# Altium schematic sheet CMPower.SchDoc
size Letter
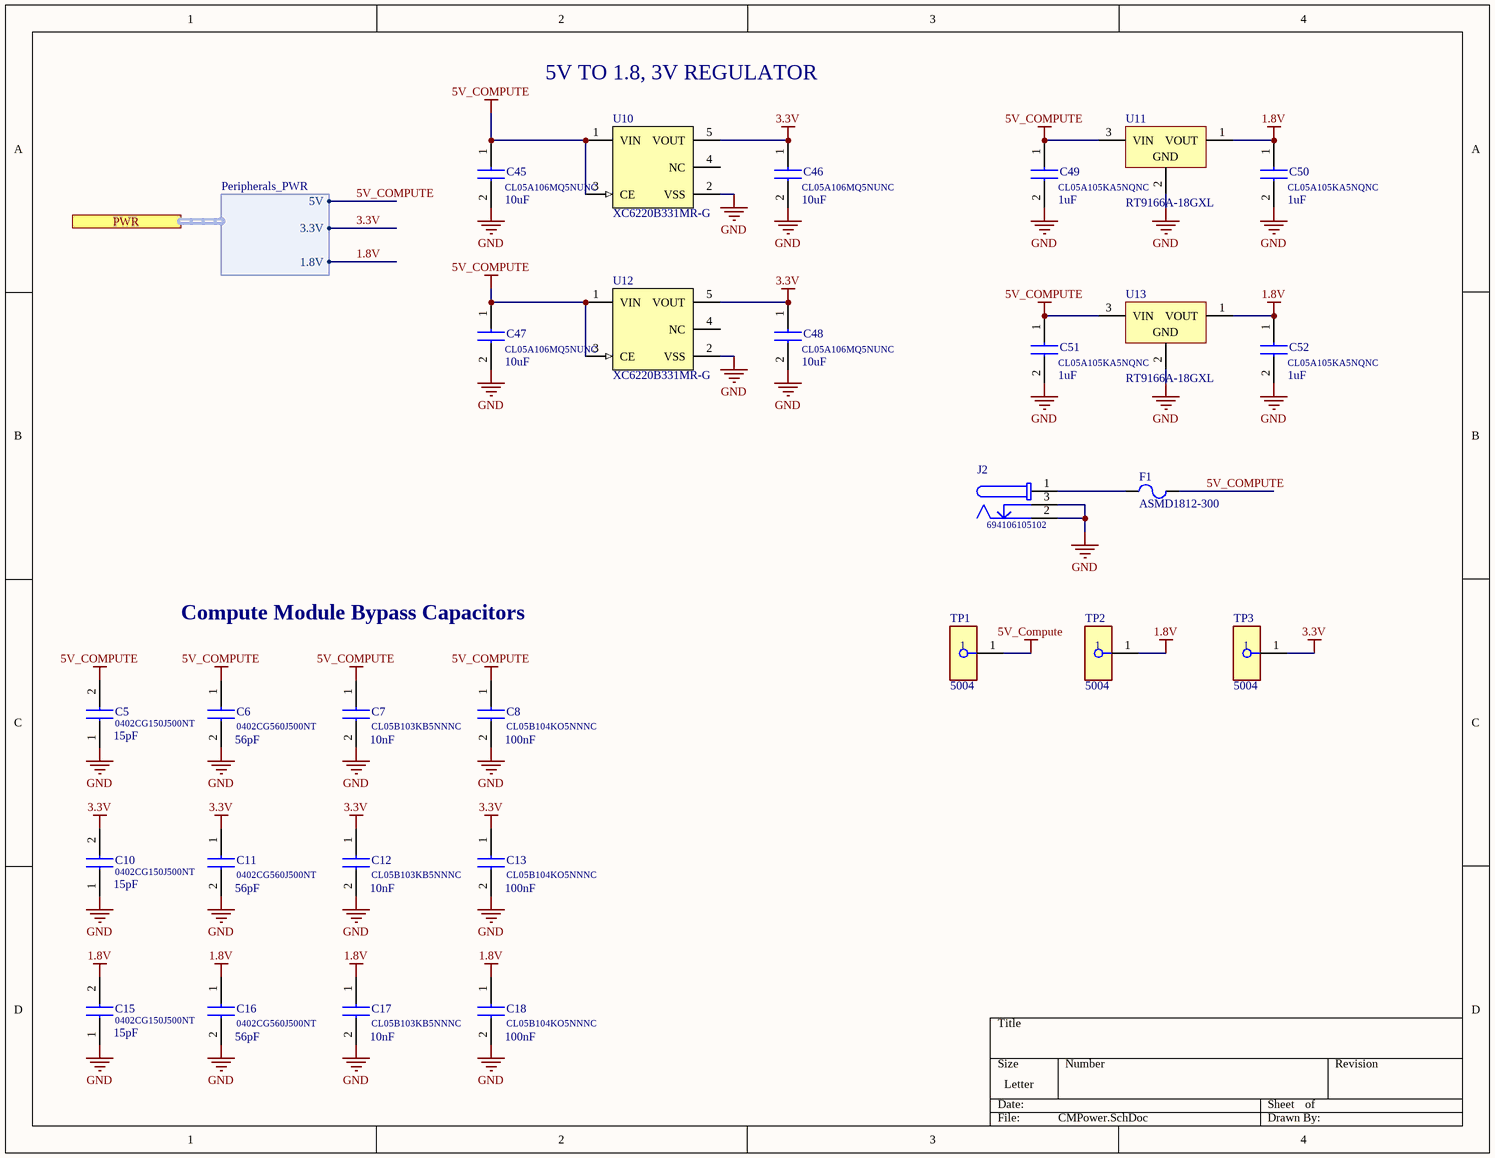
[diagram p0: CMPower.SchDoc]

## Parts
C5  0402CG150J500NT  value 15pF  [CAPC1005X90N]
C6  0402CG560J500NT  value 56pF  [CAPC1005X55N]
C7  CL05B103KB5NNNC  value 10nF  [CAPC1005X55N]
C8  CL05B104KO5NNNC  value 100nF  [CAPC1005X55N]
C10  0402CG150J500NT  value 15pF  [CAPC1005X90N]
C11  0402CG560J500NT  value 56pF  [CAPC1005X55N]
C12  CL05B103KB5NNNC  value 10nF  [CAPC1005X55N]
C13  CL05B104KO5NNNC  value 100nF  [CAPC1005X55N]
C15  0402CG150J500NT  value 15pF  [CAPC1005X90N]
C16  0402CG560J500NT  value 56pF  [CAPC1005X55N]
C17  CL05B103KB5NNNC  value 10nF  [CAPC1005X55N]
C18  CL05B104KO5NNNC  value 100nF  [CAPC1005X55N]
C45  CL05A106MQ5NUNC  value 10uF  [CAPC1005X55N]
C46  CL05A106MQ5NUNC  value 10uF  [CAPC1005X55N]
C47  CL05A106MQ5NUNC  value 10uF  [CAPC1005X55N]
C48  CL05A106MQ5NUNC  value 10uF  [CAPC1005X55N]
C49  CL05A105KA5NQNC  value 1uF  [CAPC1005X55N]
C50  CL05A105KA5NQNC  value 1uF  [CAPC1005X55N]
C51  CL05A105KA5NQNC  value 1uF  [CAPC1005X55N]
C52  CL05A105KA5NQNC  value 1uF  [CAPC1005X55N]
F1  ASMD1812-300  [LFUS-FUSE1812-71_V]
J2  694106105102  [694106105102]
TP1  5004  [FP-5004-MFG]
TP2  5004  [FP-5004-MFG]
TP3  5004  [FP-5004-MFG]
U10  XC6220B331MR-G  [TORX-SOT-25-5_M]
U11  RT9166A-18GXL  [SOT-89_N]
U12  XC6220B331MR-G  [TORX-SOT-25-5_M]
U13  RT9166A-18GXL  [SOT-89_N]

## Ports
PWR (harness Peripherals_PWR)

## Harnesses
Peripherals_PWR: 5V, 3.3V, 1.8V

## Nets
1.8V: C15.2 C16.1 C17.1 C18.1 C50.1 C52.1 TP2.1 U11.1(VOUT) U13.1(VOUT) ; port PWR.1.8V
3.3V: C10.2 C11.1 C12.1 C13.1 C46.1 C48.1 TP3.1 U10.5(VOUT) U12.5(VOUT) ; port PWR.3.3V
5V_COMPUTE: C5.2 C6.1 C7.1 C8.1 C45.1 C47.1 C49.1 C51.1 F1.2 TP1.1 U10.1(VIN) U10.3(CE) U11.3(VIN) U12.1(VIN) U12.3(CE) U13.3(VIN) ; port PWR.5V
GND: C5.1 C6.2 C7.2 C8.2 C10.1 C11.2 C12.2 C13.2 C15.1 C16.2 C17.2 C18.2 C45.2 C46.2 C47.2 C48.2 C49.2 C50.2 C51.2 C52.2 J2.2 J2.3 U10.2(VSS) U11.2(GND) U12.2(VSS) U13.2(GND)
NetF1_1: F1.1 J2.1

Not connected (* = marked no-connect by the designer): U10 4(NC); U12 4(NC)

## Notes on the sheet
- 5V TO 1.8, 3V REGULATOR
- Compute Module Bypass Capacitors

## Library data of the parts
C5 C10 C15 = C0402C150J4GACTU: 15pF 0402; Manufacturer_Name: Kemet; Datasheet Link: https://content.kemet.com/datasheets/KEM_C1002_X7R_SMD.pdf; Height: 0.55mm; Manufacturer_Part_Number: C0402C150J4GACTU; Arrow Part Number: C0402C150J4GACTU; Arrow Price/Stock: https://www.arrow.com/en/products/c0402c150j4gactu/kemet-corporation; Mouser Part Number: 80-C0402C150J4G; Mouser Price/Stock: https://www.mouser.com/Search/Refine.aspx?Keyword=80-C0402C150J4G
C6 C11 C16 = C0402C560K5RACTU: 56pF 0402; Manufacturer_Name: Kemet; Datasheet Link: https://content.kemet.com/datasheets/KEM_C1002_X7R_SMD.pdf; Height: 0.55mm; Manufacturer_Part_Number: C0402C560K5RACTU; Arrow Part Number: C0402C560K5RACTU; Mouser Part Number: 80-C0402C560K5RACTU; Mouser Price/Stock: https://www.mouser.co.uk/ProductDetail/KEMET/C0402C560K5RACTU?qs=gt1LBUVyoHmQZW5v3ySgNQ%3D%3D
C7 C12 C17 = C0402C103K8RACTU: 10nF 0402; Manufacturer_Name: Kemet; Datasheet Link: https://content.kemet.com/datasheets/KEM_C1002_X7R_SMD.pdf; Height: 0.55mm; Manufacturer_Part_Number: C0402C103K8RACTU; Arrow Part Number: C0402C103K8RACTU; Arrow Price/Stock: https://www.arrow.com/en/products/c0402c103k8ractu/kemet-corporation; Mouser Part Number: 80-C0402C103K8R; Mouser Price/Stock: https://www.mouser.co.uk/ProductDetail/KEMET/C0402C103K8RACTU?qs=JAINH4q0Y0HkMNTUebnT7w%3D%3D
C8 C13 C18 = C0402C560K5RACTU: 100nF 0402; Manufacturer_Name: Kemet; Datasheet Link: https://content.kemet.com/datasheets/KEM_C1002_X7R_SMD.pdf; Height: 0.55mm; Manufacturer_Part_Number: C0402C560K5RACTU; Arrow Part Number: C0402C560K5RACTU; Mouser Part Number: 80-C0402C560K5RACTU; Mouser Price/Stock: https://www.mouser.co.uk/ProductDetail/KEMET/C0402C560K5RACTU?qs=gt1LBUVyoHmQZW5v3ySgNQ%3D%3D
C45-C48 = C0402C560K5RACTU: 10uF 0402; Manufacturer_Name: Kemet; Datasheet Link: https://content.kemet.com/datasheets/KEM_C1002_X7R_SMD.pdf; Height: 0.55mm; Manufacturer_Part_Number: C0402C560K5RACTU; Arrow Part Number: C0402C560K5RACTU; Mouser Part Number: 80-C0402C560K5RACTU; Mouser Price/Stock: https://www.mouser.co.uk/ProductDetail/KEMET/C0402C560K5RACTU?qs=gt1LBUVyoHmQZW5v3ySgNQ%3D%3D
C49-C52 = C0402C560K5RACTU: 1uF 0402; Manufacturer_Name: Kemet; Datasheet Link: https://content.kemet.com/datasheets/KEM_C1002_X7R_SMD.pdf; Height: 0.55mm; Manufacturer_Part_Number: C0402C560K5RACTU; Arrow Part Number: C0402C560K5RACTU; Mouser Part Number: 80-C0402C560K5RACTU; Mouser Price/Stock: https://www.mouser.co.uk/ProductDetail/KEMET/C0402C560K5RACTU?qs=gt1LBUVyoHmQZW5v3ySgNQ%3D%3D
F1 = CMP-0257-00001-1: Resettable PTC, 1812, 3 A Ihold, 5 A Itrip, 8V max; PartNumber: 1812L150ZR; Itrip: 3 A; Vmax: 8 Vdc; Ihold: 1.5 A; Imax: 100 A; PackageReference: FUSE1812-71; ComponentLink1Description: Manufacturer URL; DatasheetVersion: 6/2012; ComponentLink2URL: http://www.littelfuse.com/products/resettable-ptcs/surface-mount/1812l/~/media/Electronics_Technical/Datasheets/Resettable_PTCs/Littelfuse_PTC_1812L_Datasheet.pdf; PackageVersion: 6/2012; PackageDescription: 2-Pin SMT Fuse, 4.55 x 3.24 mm Body; ComponentLink1URL: http://www.littelfuse.com/; ComponentLink2Description: Datasheet
J2 = CMP-1502-00176-1: DC Power Jack Connector with Pegs WR-DC, Male, Right Angled, SMT, 5 A, 24 V; Manufacturer: Wurth Elektronik; Plug Outer Diameter: 5.5mm; Opening Diameter: 6.4mm; Plug Inner Diameter: 2.05mm; Rated Current: 5A; Working Voltage: 24V; Publisher: WurthElektronik; Operating Temperature: -40to85degC; Packaging: TapeandReel; Part Number: 694106105102; Manufacturer URL: http://www.we-online.de; Mounting Technology: SMT; Gender: Male; Package Reference: 694106105102; Datasheet URL: http://katalog.we-online.de/em/datasheet/6941xx105102.pdf; Orientation: RightAngled
TP1-TP3 = CMP-2000-05575-2: PC TEST POINT MINIATURE YELLOW; Manufacturer: Keystone; Number Of Contacts: 1; Is Female: yes; Device Class L1: Connectors; Manufacturer Part Number: 5004; Digikey Description: PC TEST POINT MINIATURE YELLOW; ComponentLink2URL: https://www.keyelco.com/product-pdf.cfm?p=1313; Lead Free: Yes; ComponentLink2Description: Datasheet; Category: Conn; Height: 4.72mm; Octopart: https://octopart.com/5004-keystone-28591; Mouser Description: TEST POINT PC MINI .040"D YELLOW; Device Class L3: unset; Contact Material: Silver; Package: 5004; Automotive: No; Device Class L2: unset; RoHS: TRUE
U10 U12 = CMP-0599-00001-2: 1A LDO Voltage Regulator with CL discharge, 3.3 V, 1000 mA, -45 to 85 degC, 5-Pin SOT-25, RoHS, Reel; Manufacturer: Torex; Output Voltage: 3.3 V; Maximum Output Current: 1000 mA; ComponentLink1Description: Manufacturer URL; ComponentLink2URL: http://www.torex.co.jp/english/products/voltage_regulators/data/XC6220.pdf; DatasheetVersion: ETR0341-010a; ComponentLink1URL: http://www.torex.co.jp/; Mounting Technology: Surface Mount; Operating Ambient Temperature: -40 to 85 degC; PackageReference: SOT-25-5; PackageDescription: 5-Pin Small Out-Line Transistor, Body 2.9 x 1.65 mm, Pitch 0.95 mm; PartNumber: XC6220B331MR-G; RoHS: TRUE; Packing: Reel; ComponentLink2Description: Datasheet
U11 U13 = CMP-0244-00406-1: Positive Voltage Regulator, 5V, 4-Pin SOT-89, Tape and Reel; PackageVersion: 2011; DatasheetVersion: 1/02/2011; PackageDescription: 3-Pin SOT-89 Package 1.5 mm Pitch, 4.1 mm Lead Span; PackageReference: SOT-89; ComponentLink2Description: Datasheet; ComponentLink1URL: http://www.st.com; ComponentLink1Description: Manufacturer URL; ComponentLink2URL: http://www.st.com/internet/com/TECHNICAL_RESOURCES/TECHNICAL_LITERATURE/DATASHEET/CD00000446.pdf